# EAGLE design IOExpanderBoard (EAGLE 7.5.0)
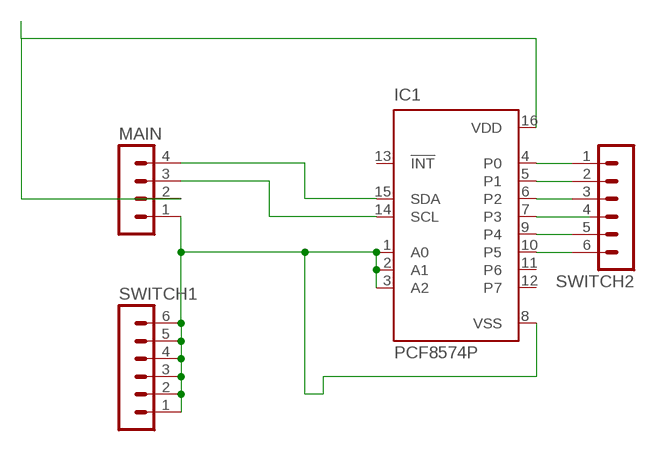
[diagram p0: schematic, sheet 1]

## Parts
IC1  PCF8574P  [DIL16]
MAIN  MA04-1  [MA04-1]
SWITCH1  MA06-1  [MA06-1]
SWITCH2  MA06-1  [MA06-1]

## Nets
N$1: IC1.9(P4) SWITCH2.5
N$2: IC1.16(VDD) MAIN.2
N$3: IC1.14(SCL) MAIN.3
N$4: IC1.15(SDA) MAIN.4
N$5: IC1.1(A0) IC1.2(A1) IC1.3(A2) IC1.8(VSS) MAIN.1 SWITCH1.1 SWITCH1.2 SWITCH1.3 SWITCH1.4 SWITCH1.5 SWITCH1.6
N$6: IC1.4(P0) SWITCH2.1
N$7: IC1.5(P1) SWITCH2.2
N$8: IC1.6(P2) SWITCH2.3
N$9: IC1.7(P3)
N$10: IC1.10(P5) SWITCH2.6
Unconnected: IC1.11(P6) IC1.12(P7) IC1.13(!INT) SWITCH2.4

## Library data of the parts
IC1 = micro-philips:PCF8574: I2C-Bus Remote 8-bit I/O expander http://www.semiconductors.philips.com/acrobat_download/datasheets/PCF8574_4.pdf; MPN: PCF8574PN; OC_FARNELL: 204020; OC_NEWARK: 11N8515
MAIN = con-lstb:MA04-1: PIN HEADER; OC_FARNELL: unknown; OC_NEWARK: unknown
SWITCH1 SWITCH2 = con-lstb:MA06-1: PIN HEADER; OC_FARNELL: unknown; OC_NEWARK: unknown

## Board
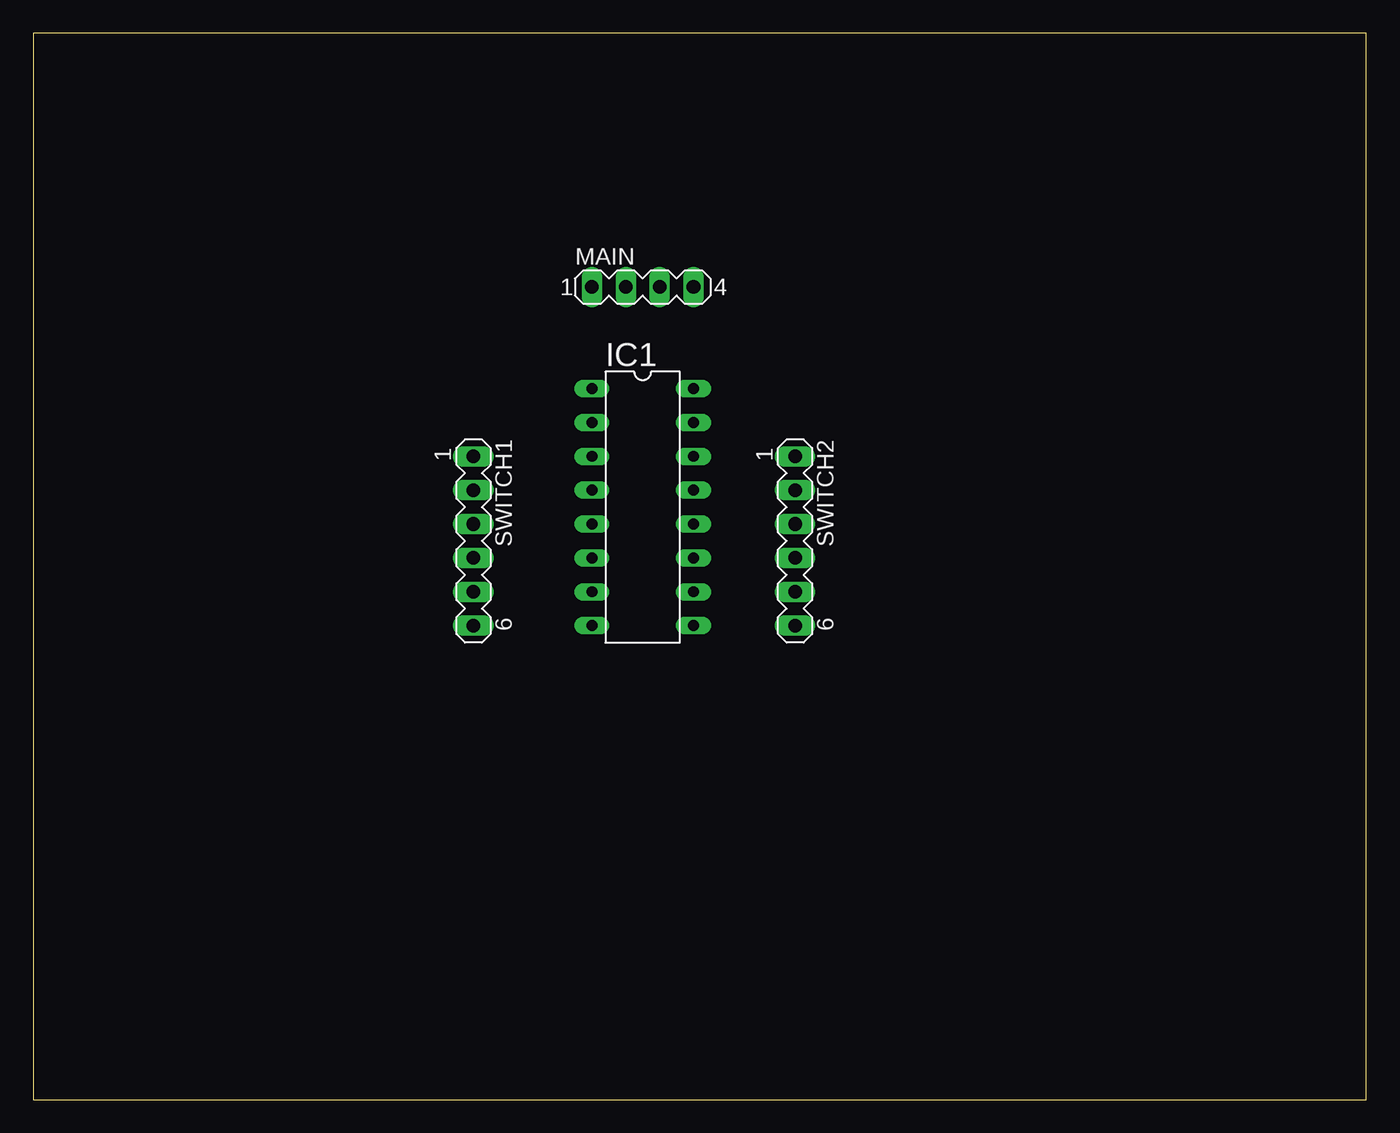
[diagram p1: board, top side]
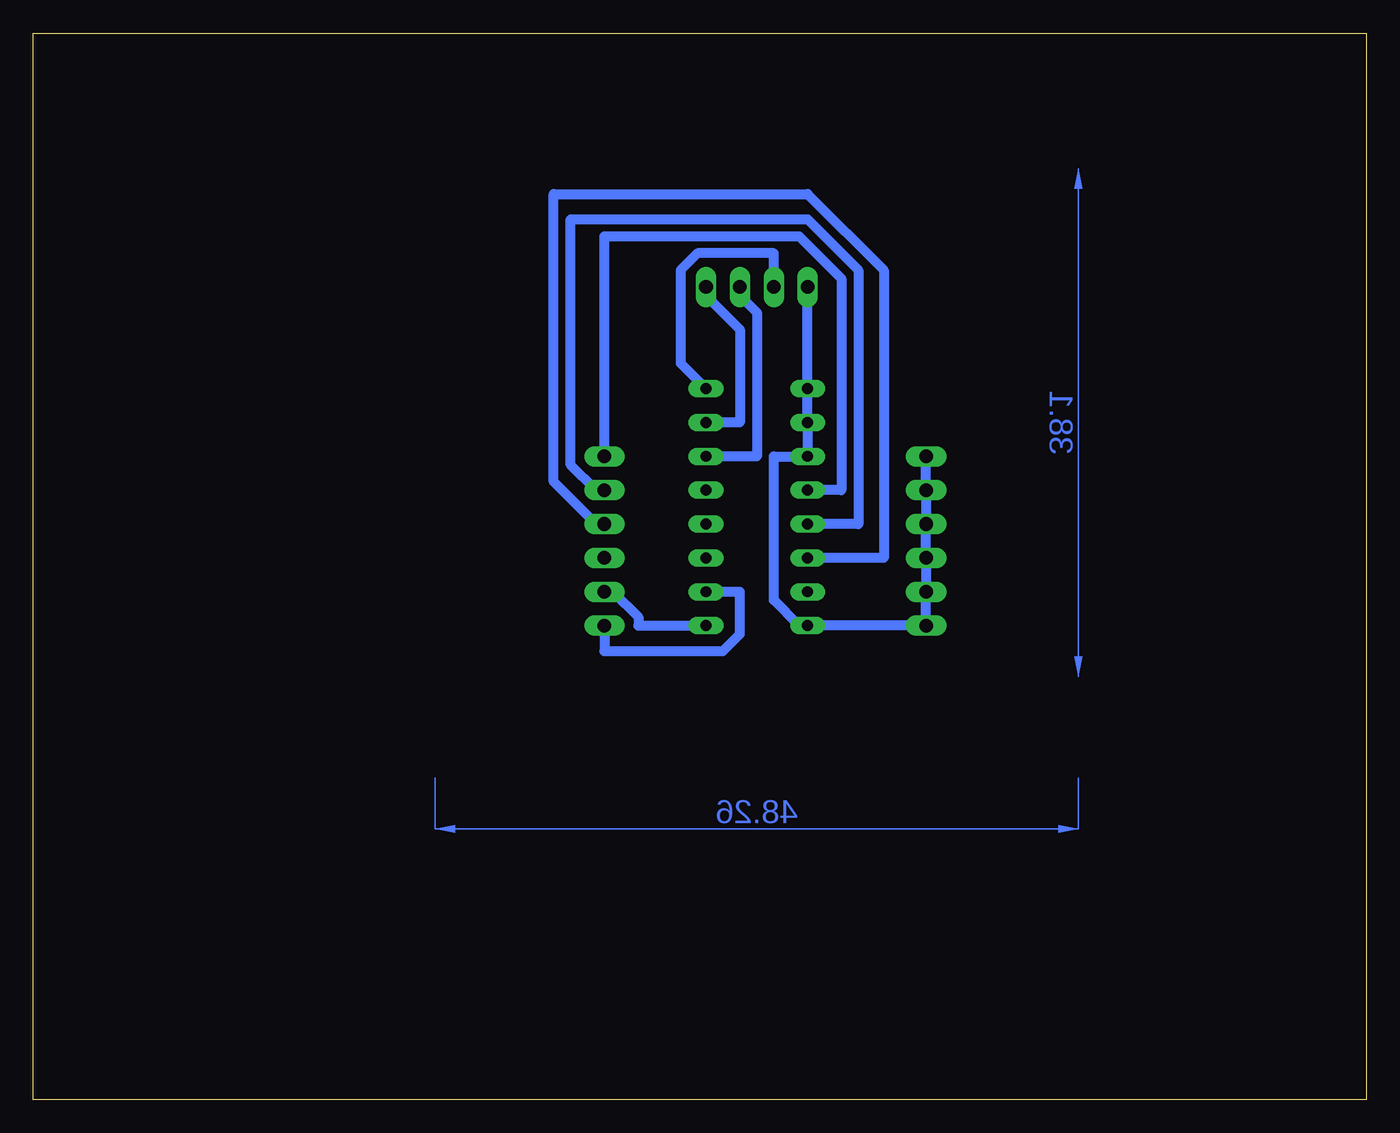
[diagram p2: board, bottom side, seen from below]

Size 100 x 80 mm. Coordinates in mm from the lower left corner, seen from the top.
Outline: 0,0 100,0 100,80 0,80 0,0
Copper layers (1*16): Top 0.035mm / dielectric 1.5mm / Bottom 0.035mm
Design rules "Default": minimum track width 30mil, minimum drill 24mil, track to track 12mil, track to pad 15mil, pad to pad 8mil, via to via 8mil, smd to smd 8mil, copper to edge 40mil, drill to drill 8mil, minimum pad ring 10mil, minimum via ring 8mil, stop-mask expansion 4mil, vias tented up to drill 0mil, thermal gap 10mil

### Footprints (pad centres in the part's own frame; a part is rotated, then mirrored left to right if it is on the bottom)
DIL16 = drill 0.813 long: 1 -8.89,-3.81; 2 -6.35,-3.81; 3 -3.81,-3.81; 4 -1.27,-3.81; 5 1.27,-3.81; 6 3.81,-3.81; 7 6.35,-3.81; 8 8.89,-3.81; 9 8.89,3.81; 10 6.35,3.81; 11 3.81,3.81; 12 1.27,3.81; 13 -1.27,3.81; 14 -3.81,3.81; 15 -6.35,3.81; 16 -8.89,3.81
MA04-1 = drill 1.016 long: 1 -3.81,0; 2 -1.27,0; 3 1.27,0; 4 3.81,0
MA06-1 = drill 1.016 long: 1 -6.35,0; 2 -3.81,0; 3 -1.27,0; 4 1.27,0; 5 3.81,0; 6 6.35,0

### Placement (x,y rotation side)
IC1  45.72,44.45 270 top
MAIN  45.72,60.96 0 top
SWITCH1  33.02,41.91 270 top
SWITCH2  57.15,41.91 270 top

### Tracks (layer width: path | path; a pad name or v marks a point on that pad's centre or on a via)
N$1
  Bottom 0.762: IC1.9 54.61,35.56 54.61,36.2 56.52,38.1 SWITCH2.5
N$2
  Bottom 0.762: IC1.16 51.44,55.24 51.44,62.23 50.16,63.5 44.45,63.5 MAIN.2
N$3
  Bottom 0.762: IC1.14 45.72,48.26 45.72,59.05 46.99,60.33 MAIN.3
N$4
  Bottom 0.762: IC1.15 46.99,50.8 46.99,57.78 49.53,60.33 MAIN.4
N$5
  Bottom 0.762: MAIN.1 IC1.1 IC1.2 IC1.3 44.45,48.26 44.45,37.47 42.55,35.56 IC1.8 SWITCH1.6 SWITCH1.5 SWITCH1.4 SWITCH1.3 SWITCH1.2 SWITCH1.1
N$6
  Bottom 0.762: IC1.4 39.37,45.72 39.37,61.59 42.55,64.77 57.15,64.77 SWITCH2.1
N$7
  Bottom 0.762: IC1.5 38.1,43.18 38.1,62.23 41.91,66.04 59.69,66.04 59.69,47.62 57.78,45.72 SWITCH2.2
N$8
  Bottom 0.762: IC1.6 36.2,40.64 36.2,62.23 41.91,67.94 60.96,67.94 60.96,46.35 57.78,43.18 SWITCH2.3
N$10
  Bottom 0.762: IC1.10 46.99,38.1 46.99,34.92 48.26,33.66 57.15,33.66 SWITCH2.6
(copper drawn outside any net)
  shapes: Bottom area x2